# Altium project LedBlinker End.PrjPCB
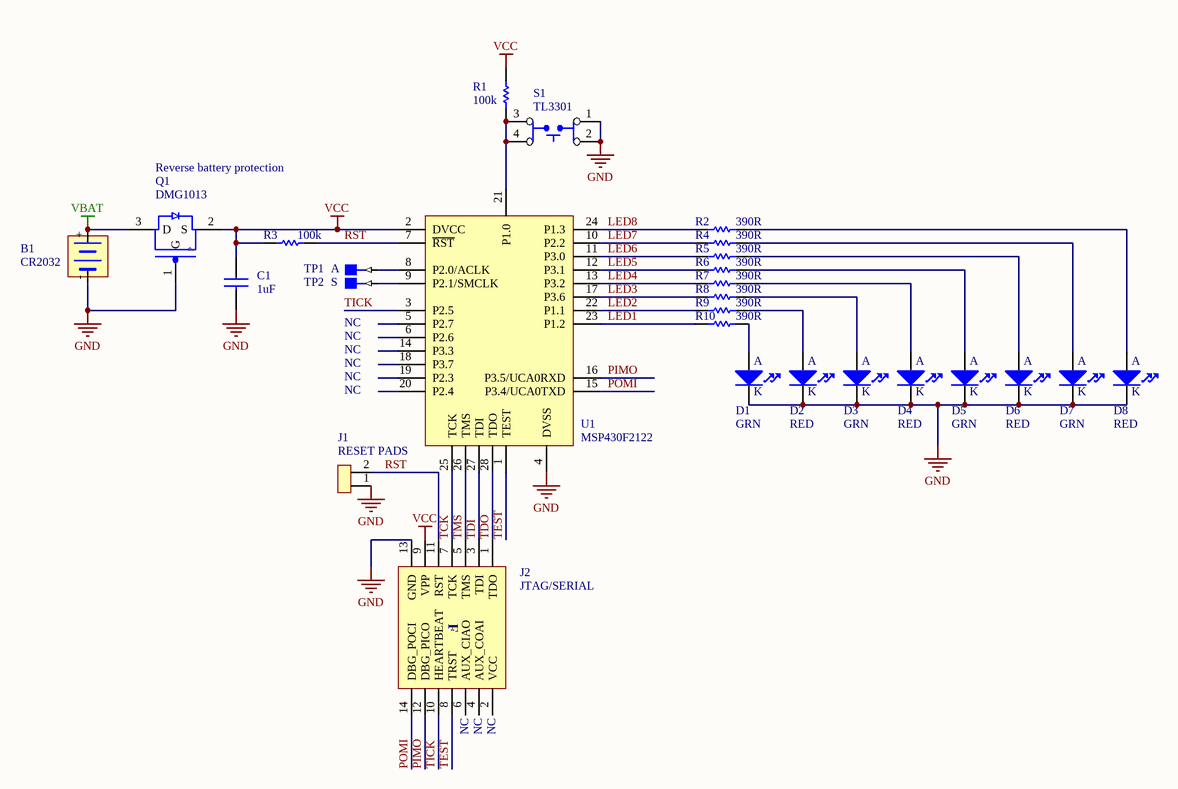
[diagram p0: LedBlinker End.SchDoc]
1 sheet, 27 parts. Net scope: hierarchical (ports join the sheet entries above them; power ports are global).
Board files: LedBlinker End.PcbDoc, LedBlinker Mechanical.PcbDoc, LedBlinker Fine Placement.PcbDoc, LedBlinker Rats Nest.PcbDoc, LedBlinker Rough Placement.PcbDoc, LedBlinker End Copper.PcbDoc, LedBlinker Mechanical Rounded.PcbDoc

## Sheet LedBlinker End.SchDoc: LED Blinker
size Letter; Author: JRL; Organization: Engenuics Technologies Inc; Address1: 6680A Mirah Road; Address2: Saanichton, BC V8M 1Z4; Address3: CANADA; Address4: 1-888-912-3451; DocumentNumber: LedBlinker; Revision: 01; SheetNumber: 1; SheetTotal: 1; PageSetup: Record=PageOptions|CenterHorizontal=True|CenterVertical=True|PrintScale=0.98|XCorrection=1.00|YCorrection=1.00|PrintKind=1|BorderSize=5000000|LeftOffset=0|BottomOffset=0|Orientation=2|PaperLength=1000|PaperWidth=1000|Scale=100|PaperSource=15|PrintQuality=600|MediaType=1|DitherType=10|PaperKind=Letter|PrintScaleMode=1

### Parts
B1  CR2032  [CONN BATTERY HOLDER CR2032]
C1  1uF  [0603]
D1  GRN  [PLCC-2 AK]
D2  RED  [PLCC-2 AK]
D3  GRN  [PLCC-2 AK]
D4  RED  [PLCC-2 AK]
D5  GRN  [PLCC-2 AK]
D6  RED  [PLCC-2 AK]
D7  GRN  [PLCC-2 AK]
D8  RED  [PLCC-2 AK]
J1  RESET PADS  [JUMPER POINTS]  (no BOM)
J2  JTAG/SERIAL  [CONN 14POS 7X2 SMT FEMALE SMALL]
Q1  DMG1013  [SC-70-3]
R1  100k  [0603]
R2  390R  [0603]
R3  100k  [0603]
R4  390R  [0603]
R5  390R  [0603]
R6  390R  [0603]
R7  390R  [0603]
R8  390R  [0603]
R9  390R  [0603]
R10  390R  [0603]
S1  TL3301  [SWITCH TACT SMT TL3301 J LEAD]
TP1  A  [TEST POINT SMT TINY]  (no BOM)
TP2  S  [TEST POINT SMT TINY]  (no BOM)
U1  MSP430F2122  [TSSOP28]

### Nets
GND: B1.- C1.2 D1.K D2.K D3.K D4.K D5.K D6.K D7.K D8.K J1.1 J2.13(GND) Q1.1(G) S1.1(X1) S1.2(X2) U1.4(DVSS)
VBAT: B1.+ Q1.3(D)
VCC: C1.1 J2.9(VPP) Q1.2(S) R1.2 R3.2 U1.2(DVCC)
LED1: R10.1 U1.23(P1.2)
LED2: R9.1 U1.22(P1.1)
LED3: R8.1 U1.17(P3.6)
LED4: R7.1 U1.13(P3.2)
LED5: R6.1 U1.12(P3.1)
LED6: R5.1 U1.11(P3.0)
LED7: R4.1 U1.10(P2.2)
LED8: R2.1 U1.24(P1.3)
PIMO: J2.12(DBG_PICO) U1.16(P3.5/UCA0RXD)
POMI: J2.14(DBG_POCI) U1.15(P3.4/UCA0TXD)
RST: J1.2 J2.11(RST) R3.1 U1.7(~{RST})
TCK: J2.7(TCK) U1.25(TCK)
TDI: J2.3(TDI) U1.27(TDI)
TDO: J2.1(TDO) U1.28(TDO)
TEST: J2.8(TRST) U1.1(TEST)
TICK: J2.10(HEARTBEAT) U1.3(P2.5)
TMS: J2.5(TMS) U1.26(TMS)
NetD1_A: D1.A R10.2
NetD2_A: D2.A R9.2
NetD3_A: D3.A R8.2
NetD4_A: D4.A R7.2
NetD5_A: D5.A R6.2
NetD6_A: D6.A R5.2
NetD7_A: D7.A R4.2
NetD8_A: D8.A R2.2
NetR1_1: R1.1 S1.3(Y1) S1.4(Y2) U1.21(P1.0)
NetTP1_1: TP1.1 U1.8(P2.0/ACLK)
NetTP2_1: TP2.1 U1.9(P2.1/SMCLK)

Not connected (* = marked no-connect by the designer): J2 2(VCC) 4(AUX_COAI) 6(AUX_CIAO); U1 5(P2.7) 6(P2.6) 14(P3.3) 18(P3.7) 19(P2.3) 20(P2.4)

### Notes on the sheet
- Reverse battery protection
- NC
- (near J2) NC
- 6680A MIRAH ROAD
- SAANICHTON, BC
- CANADA  V8M 1Z4
- Title:
- Number:
- Date:
- Version
- Sheet:
- of
- Author:
- 1-888-912-3451
- File:
- (in symbol CONN JTAG/SERIAL DEBUG 14POS FEMALE) F
- (in symbol TRANS PMOS 1G 2S 3D) P

### Library data of the parts
B1 = CONN BATTERY HOLDER CR2032: 3V Coincell Battery; 2. Manufacturer: FCI; 3. Manufacturer Part Number: BK-912; 5. Internal Part Number: 100192; 1. Description: CONN HOLDER COIN CELL 20MM SMD; 7. Modified By: JRL; 4. Digi-Key Part Number: BK-912-ND; 6. Last Modified: 2012-09-03
C1 = CAPACITOR NON-POLARIZED: 5. Internal Part Number: 100009; 3. Manufacturer Part Number: EMK107BJ105KA-T; 2. Manufacturer: Taiyo; 1. Description: CAP CER 1uF 10% X5R 16V 0603 SMT; 7. Modified By: JRL; 4. Digi-Key Part Number: 587-1251-2-ND; 6. Last Modified: 2014-12-15
D1 D3 D5 D7 = LED AK: 2. Manufacturer: Kingbright; 3. Manufacturer Part Number: AA3528CGSK; 5. Internal Part Number: 100110; 1. Description: LED PLCC2 GREEN ROUND CLEAR SMD; 7. Modified By: JRL; 4. Digi-Key Part Number: 754-1528-2-ND; 6. Last Modified: 2014-12-15
D2 D4 D6 D8 = LED AK: 2. Manufacturer: Kingbright; 3. Manufacturer Part Number: AA3528SURSK; 5. Internal Part Number: 100113; 1. Description: LED PLCC2 RED ROUND CLEAR SMD; 7. Modified By: JRL; 4. Digi-Key Part Number: 754-1537-2-ND; 6. Last Modified: 2014-12-15
J1 = CONN SIP 2: 2. Manufacturer: *; 3. Manufacturer Part Number: *; 1. Description: *; 4. Digi-Key Part Number: *; 5. Internal Part Number: *; 6. Last Modified: *; 7. Modified By: *
J2 = CONN JTAG/SERIAL DEBUG 14POS FEMALE: 2. Manufacturer: FCI; 3. Manufacturer Part Number: 20021321-00014T4LF; 5. Internal Part Number: 100254; 1. Description: CONN TERMINAL 14POS 7X2 1.27MM VERT SMD; 7. Modified By: JRL; 4. Digi-Key Part Number: 609-3771-ND; 6. Last Modified: 2014-12-15
Q1 = TRANS PMOS 1G 2S 3D: 2. Manufacturer: Diodes Incorporated; 3. Manufacturer Part Number: DMG1013UW-7; 5. Internal Part Number: 100279; 1. Description: TRANS PMOS 20V 820MA SOT323; 7. Modified By: JRL; 4. Digi-Key Part Number: DMG1013UW-7DICT-ND; 6. Last Modified: 2014-12-15
R1 R3 = RESISTOR: 5. Internal Part Number: 100078; 2. Manufacturer: Yageo; 3. Manufacturer Part Number: RC0603FR-07100KL; 1. Description: RES 100K OHM 1/10W 1% 0603 SMD; 7. Modified By: JRL; 4. Digi-Key Part Number: 311-100KHRTR-ND; 6. Last Modified: 2014-12-15
R2 R4-R10 = RESISTOR: 5. Internal Part Number: 100098; 2. Manufacturer: Yageo; 3. Manufacturer Part Number: RC0603FR-07390RL; 1. Description: RES 390 OHM 1/10W 1% 0603; 7. Modified By: JRL; 4. Digi-Key Part Number: 311-390HRTR-ND; 6. Last Modified: 2014-12-15
S1 = SWITCH SPST TL3301 JLEAD: SPST TACT SWITCH; 2. Manufacturer: E-Switch; 3. Manufacturer Part Number: TL3301AF160QJ; 5. Internal Part Number: 100278; 1. Description: SWITCH TACT JLEAD 6X6MM SMT; 7. Modified By: JRL; 4. Digi-key Part Number: EG4374TR-ND; 6. Last Modified: 2014-10-24
TP1 TP2 = TEST POINT SMT: 1. Description: Test pad; 7. Modified By: JRL; 2. Manufacturer: N/A; 3. Manufacturer Part Number: N/A; 4. Digi-key Part Number: N/A; 5. Internal Part Number: N/A; 6. Last Modified: June 12, 2008
U1 = MCU MSP430F2122 TSSOP28 LED BLINKER: 2. Manufacturer: Texas Instruments; 3. Manufacturer Part Number: MSP430F2122IIPW; 5. Internal Part Number: 100207; 7. Modified By: JRL; 1. Description: MCU MSP430F2122 TSSOP28; 4. Digi-Key Part Number: 296-23363-2-ND; 6. Last Modified: 2012-11-14